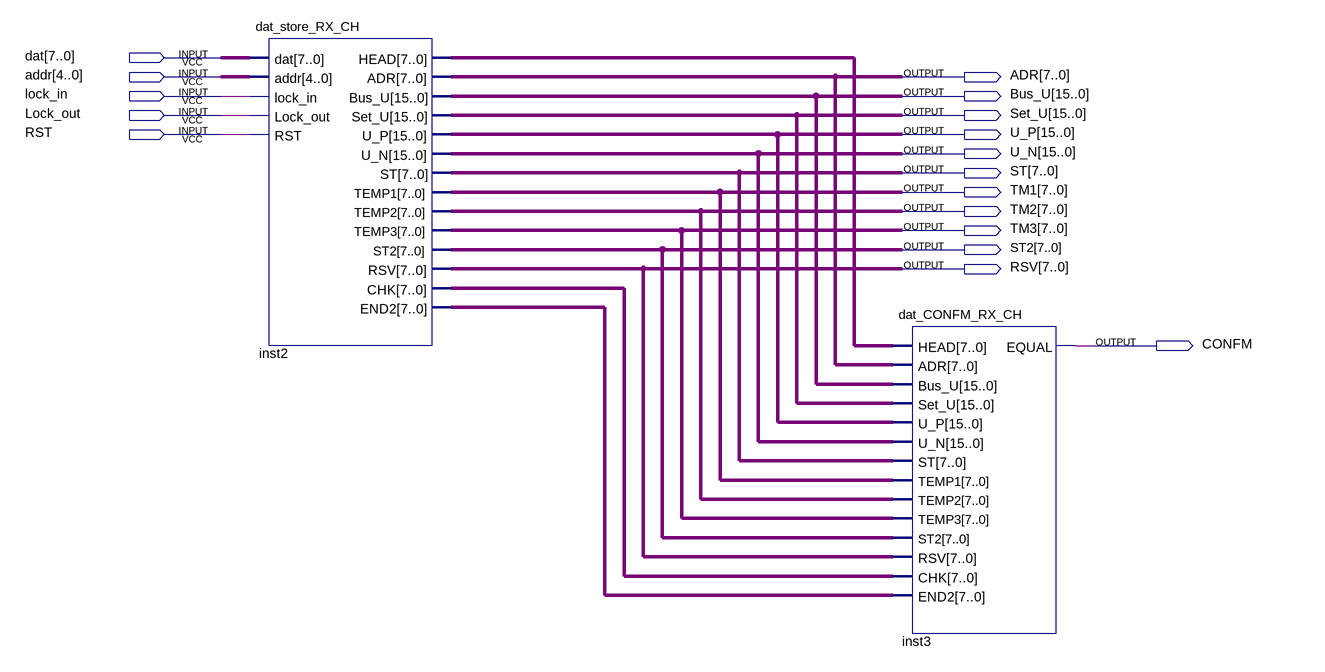
[diagram p0: schematic sheet]
// Quartus schematic RCV_DEAL_CH.bdf as structural Verilog: 2 symbols, 17 pins
module RCV_DEAL_CH (
  input  [7:0] dat,
  input  [4:0] addr,
  input  lock_in,
  input  Lock_out,
  input  RST,
  output [7:0] ADR,
  output [15:0] Bus_U,
  output [15:0] Set_U,
  output [15:0] U_P,
  output [15:0] U_N,
  output [7:0] ST,
  output [7:0] TM1,
  output [7:0] TM2,
  output [7:0] TM3,
  output [7:0] ST2,
  output [7:0] RSV,
  output CONFM
);

  wire [7:0] inst2_chk, inst2_end2, inst2_head;

  dat_store_RX_CH inst2 (
    .dat(dat), .addr(addr), .lock_in(lock_in), .Lock_out(Lock_out), .RST(RST), .HEAD(inst2_head), .ADR(ADR),
    .Bus_U(Bus_U), .Set_U(Set_U), .U_P(U_P), .U_N(U_N), .ST(ST), .TEMP1(TM1), .TEMP2(TM2), .TEMP3(TM3),
    .ST2(ST2), .RSV(RSV), .CHK(inst2_chk), .END2(inst2_end2));
  dat_CONFM_RX_CH inst3 (
    .HEAD(inst2_head), .ADR(ADR), .Bus_U(Bus_U), .Set_U(Set_U), .U_P(U_P), .U_N(U_N), .ST(ST), .TEMP1(TM1),
    .TEMP2(TM2), .TEMP3(TM3), .ST2(ST2), .RSV(RSV), .CHK(inst2_chk), .END2(inst2_end2), .EQUAL(CONFM));
endmodule
